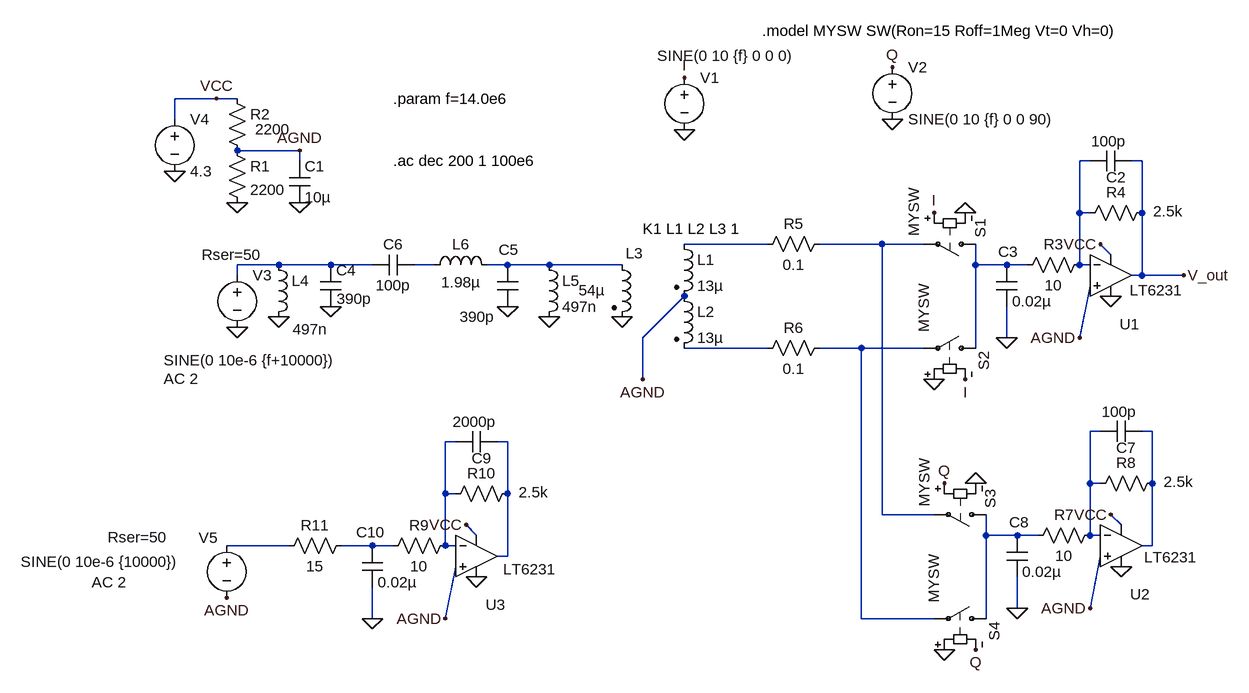
[diagram p0: schematic AC_SDR_IQ.asc]
AC_SDR_IQ.asc, the LTspice schematic file:
Version 4
SHEET 1 880 920
WIRE -1072 -192 -1136 -192
WIRE -1040 -192 -1072 -192
WIRE -1136 -160 -1136 -192
WIRE -944 -112 -1040 -112
WIRE -944 -96 -944 -112
WIRE 272 -96 256 -96
WIRE 352 -96 336 -96
WIRE 256 -16 256 -96
WIRE 272 -16 256 -16
WIRE 352 -16 352 -96
WIRE -224 32 -352 32
WIRE -48 32 -144 32
WIRE 16 32 -48 32
WIRE 304 48 288 32
WIRE -976 64 -1040 64
WIRE -896 64 -976 64
WIRE -832 64 -896 64
WIRE -736 64 -768 64
WIRE -624 64 -656 64
WIRE -560 64 -624 64
WIRE -448 64 -560 64
WIRE 96 64 96 32
WIRE 144 64 96 64
WIRE 176 64 144 64
WIRE 256 64 256 -16
WIRE 272 64 256 64
WIRE -1040 80 -1040 64
WIRE 352 80 352 -16
WIRE 352 80 336 80
WIRE 416 80 352 80
WIRE -416 176 -352 112
WIRE 144 176 144 128
WIRE 256 176 272 96
WIRE -224 192 -352 192
WIRE -80 192 -144 192
WIRE 16 192 -80 192
WIRE 96 192 96 64
WIRE -416 240 -416 176
WIRE 288 320 272 320
WIRE 368 320 352 320
WIRE -704 336 -720 336
WIRE -624 336 -640 336
WIRE 272 400 272 320
WIRE 288 400 272 400
WIRE 368 400 368 320
WIRE -720 416 -720 336
WIRE -704 416 -720 416
WIRE -624 416 -624 336
WIRE -48 448 -48 32
WIRE 32 448 -48 448
WIRE 320 464 304 448
WIRE -672 480 -688 464
WIRE 112 480 112 448
WIRE 160 480 112 480
WIRE 192 480 160 480
WIRE 272 480 272 400
WIRE 288 480 272 480
WIRE -960 496 -1056 496
WIRE -832 496 -880 496
WIRE -800 496 -832 496
WIRE -720 496 -720 416
WIRE -704 496 -720 496
WIRE 368 496 368 400
WIRE 368 496 352 496
WIRE -624 512 -624 416
WIRE -624 512 -640 512
WIRE 160 592 160 544
WIRE 272 592 288 512
WIRE -832 608 -832 560
WIRE -720 608 -704 528
WIRE -80 608 -80 192
WIRE 32 608 -80 608
WIRE 112 608 112 480
FLAG -1040 160 0
FLAG -448 144 0
FLAG -1136 -80 0
FLAG -1040 -32 0
FLAG -944 -32 0
FLAG -352 -144 0
FLAG 80 -16 0
FLAG 32 240 0
FLAG -32 -160 0
FLAG -944 -112 AGND
FLAG -416 240 AGND
FLAG 256 176 AGND
FLAG -352 -224 I
FLAG 32 -16 I
FLAG -32 -240 Q
FLAG -1072 -192 VCC
FLAG 288 32 VCC
FLAG 304 112 0
FLAG 80 240 I
FLAG 144 176 0
FLAG 416 80 V_out
FLAG -976 144 0
FLAG -896 128 0
FLAG -624 128 0
FLAG 96 400 0
FLAG 48 656 0
FLAG 272 592 AGND
FLAG 48 400 Q
FLAG 304 448 VCC
FLAG 320 528 0
FLAG 96 656 Q
FLAG 160 592 0
FLAG -720 608 AGND
FLAG -688 464 VCC
FLAG -672 544 0
FLAG -832 608 0
FLAG -1056 576 AGND
FLAG -560 144 0
SYMBOL Opamps\\LT6231 304 80 R0
WINDOW 0 14 75 Left 2
WINDOW 3 29 23 Left 2
SYMATTR InstName U1
SYMBOL sw 112 32 R90
WINDOW 0 -39 9 Left 2
WINDOW 3 -86 111 Left 2
SYMATTR InstName S1
SYMATTR Value MYSW
SYMBOL sw 112 192 M270
WINDOW 0 -34 3 Left 2
SYMATTR InstName S2
SYMATTR Value MYSW
SYMBOL voltage -352 -240 R0
WINDOW 123 0 0 Left 0
WINDOW 39 0 0 Left 0
WINDOW 3 -42 -18 Left 2
SYMATTR Value SINE(0 10 {f} 0 0 0)
SYMATTR InstName V1
SYMBOL voltage -32 -256 R0
WINDOW 123 0 0 Left 0
WINDOW 39 0 0 Left 0
SYMATTR InstName V2
SYMATTR Value SINE(0 10 {f} 0 0 90)
SYMBOL voltage -1040 64 R0
WINDOW 123 -113 175 Left 2
WINDOW 39 -55 -16 Left 2
WINDOW 3 -113 147 Left 2
SYMATTR Value2 AC 2
SYMATTR SpiceLine Rser=50
SYMATTR Value SINE(0 10e-6 {f+10000})
SYMATTR InstName V3
SYMBOL ind2 -368 16 R0
SYMATTR InstName L1
SYMATTR Value 13µ
SYMATTR Type ind
SYMBOL ind2 -368 96 R0
SYMATTR InstName L2
SYMATTR Value 13µ
SYMATTR Type ind
SYMBOL ind2 -464 48 R0
WINDOW 0 22 -2 Left 2
WINDOW 3 -51 55 Left 2
SYMATTR InstName L3
SYMATTR Value 54µ
SYMATTR Type ind
SYMBOL res -1056 -128 R0
SYMATTR InstName R1
SYMATTR Value 2200
SYMBOL res -1056 -208 R0
WINDOW 3 44 63 Left 2
SYMATTR Value 2200
SYMATTR InstName R2
SYMBOL cap -960 -96 R0
SYMATTR InstName C1
SYMATTR Value 10µ
SYMBOL voltage -1136 -176 R0
WINDOW 123 0 0 Left 0
WINDOW 39 0 0 Left 0
SYMATTR InstName V4
SYMATTR Value 4.3
SYMBOL res 272 48 R90
WINDOW 0 0 56 VBottom 2
WINDOW 3 32 56 VTop 2
SYMATTR InstName R3
SYMATTR Value 10
SYMBOL res 368 -32 R90
WINDOW 0 0 56 VBottom 2
WINDOW 3 -2 -24 VTop 2
SYMATTR InstName R4
SYMATTR Value 2.5k
SYMBOL cap 336 -112 R90
WINDOW 0 57 24 VBottom 2
WINDOW 3 -30 35 VTop 2
SYMATTR InstName C2
SYMATTR Value 100p
SYMBOL cap 128 64 R0
WINDOW 0 3 -20 Left 2
SYMATTR InstName C3
SYMATTR Value 0.02µ
SYMBOL cap -912 64 R0
WINDOW 3 25 52 Left 2
SYMATTR Value 390p
SYMATTR InstName C4
SYMBOL cap -640 64 R0
WINDOW 0 2 -23 Left 2
WINDOW 3 -58 80 Left 2
SYMATTR InstName C5
SYMATTR Value 390p
SYMBOL cap -768 48 R90
WINDOW 0 0 32 VBottom 2
WINDOW 3 32 32 VTop 2
SYMATTR InstName C6
SYMATTR Value 100p
SYMBOL ind -992 48 R0
WINDOW 3 37 115 Left 2
SYMATTR Value 497n
SYMATTR InstName L4
SYMBOL ind -576 48 R0
SYMATTR InstName L5
SYMATTR Value 497n
SYMBOL ind -752 80 R270
WINDOW 0 32 56 VTop 2
WINDOW 3 5 56 VBottom 2
SYMATTR InstName L6
SYMATTR Value 1.98µ
SYMBOL Opamps\\LT6231 320 496 R0
WINDOW 0 14 75 Left 2
WINDOW 3 35 18 Left 2
SYMATTR InstName U2
SYMBOL sw 128 448 R90
WINDOW 0 -39 9 Left 2
WINDOW 3 -86 111 Left 2
SYMATTR InstName S3
SYMATTR Value MYSW
SYMBOL sw 128 608 M270
WINDOW 0 -34 3 Left 2
SYMATTR InstName S4
SYMATTR Value MYSW
SYMBOL res 288 464 R90
WINDOW 0 0 56 VBottom 2
WINDOW 3 32 56 VTop 2
SYMATTR InstName R7
SYMATTR Value 10
SYMBOL res 384 384 R90
WINDOW 0 0 56 VBottom 2
WINDOW 3 -2 -24 VTop 2
SYMATTR InstName R8
SYMATTR Value 2.5k
SYMBOL cap 352 304 R90
WINDOW 0 57 24 VBottom 2
WINDOW 3 -30 35 VTop 2
SYMATTR InstName C7
SYMATTR Value 100p
SYMBOL cap 144 480 R0
WINDOW 0 4 -20 Left 2
SYMATTR InstName C8
SYMATTR Value 0.02µ
SYMBOL res -128 16 R90
WINDOW 0 0 56 VBottom 2
WINDOW 3 32 56 VTop 2
SYMATTR InstName R5
SYMATTR Value 0.1
SYMBOL res -128 176 R90
WINDOW 0 0 56 VBottom 2
WINDOW 3 32 56 VTop 2
SYMATTR InstName R6
SYMATTR Value 0.1
SYMBOL Opamps\\LT6231 -672 512 R0
WINDOW 0 14 75 Left 2
WINDOW 3 41 20 Left 2
SYMATTR InstName U3
SYMBOL res -704 480 R90
WINDOW 0 0 56 VBottom 2
WINDOW 3 32 56 VTop 2
SYMATTR InstName R9
SYMATTR Value 10
SYMBOL res -608 400 R90
WINDOW 0 0 56 VBottom 2
WINDOW 3 -2 -24 VTop 2
SYMATTR InstName R10
SYMATTR Value 2.5k
SYMBOL cap -640 320 R90
WINDOW 0 57 24 VBottom 2
WINDOW 3 -30 35 VTop 2
SYMATTR InstName C9
SYMATTR Value 2000p
SYMBOL cap -848 496 R0
WINDOW 0 -9 -21 Left 2
SYMATTR InstName C10
SYMATTR Value 0.02µ
SYMBOL res -864 480 R90
WINDOW 0 0 56 VBottom 2
WINDOW 3 32 56 VTop 2
SYMATTR InstName R11
SYMATTR Value 15
SYMBOL voltage -1056 480 R0
WINDOW 123 -208 72 Left 2
WINDOW 39 -183 3 Left 2
WINDOW 3 -317 41 Left 2
WINDOW 0 -43 4 Left 2
SYMATTR Value2 AC 2
SYMATTR SpiceLine Rser=50
SYMATTR Value SINE(0 10e-6 {10000})
SYMATTR InstName V5
TEXT -232 -296 Left 2 !.model MYSW SW(Ron=15 Roff=1Meg Vt=0 Vh=0)
TEXT -416 8 Left 2 !K1 L1 L2 L3 1
TEXT -800 -192 Left 2 !.param f=14.0e6
TEXT -800 -96 Left 2 !.ac dec 200 1 100e6

The netlist it stands for:
* AC_SDR_IQ.asc
XU1 AGND N001 V_out VCC 0 LT6231  ; pins In+ In- OUT V+ V-
S1 N007 N003 I 0 MYSW
S2 N007 N009 0 I MYSW
V1 I 0 SINE(0 10 {f} 0 0 0)
V2 Q 0 SINE(0 10 {f} 0 0 90)
V3 N004 0 SINE(0 10e-6 {f+10000}) AC 2 Rser=50
L1 N002 AGND 13µ
L2 AGND N008 13µ
L3 N006 0 54µ
R1 AGND 0 2200
R2 VCC AGND 2200
C1 AGND 0 10µ
V4 VCC 0 4.3
R3 N001 N007 10
R4 V_out N001 2.5k
C2 V_out N001 100p
C3 N007 0 0.02µ
C4 N004 0 390p
C5 N006 0 390p
C6 N005 N004 100p
L4 N004 0 497n
L5 N006 0 497n
L6 N005 N006 1.98µ
XU2 AGND N010 N011 VCC 0 LT6231  ; pins In+ In- OUT V+ V-
S3 N014 N003 Q 0 MYSW
S4 N014 N009 0 Q MYSW
R7 N010 N014 10
R8 N011 N010 2.5k
C7 N011 N010 100p
C8 N014 0 0.02µ
R5 N003 N002 0.1
R6 N009 N008 0.1
XU3 AGND N012 N013 VCC 0 LT6231  ; pins In+ In- OUT V+ V-
R9 N012 N016 10
R10 N013 N012 2.5k
C9 N013 N012 2000p
C10 N016 0 0.02µ
R11 N016 N015 15
V5 N015 AGND SINE(0 10e-6 {10000}) AC 2 Rser=50
.model MYSW SW(Ron=15 Roff=1Meg Vt=0 Vh=0)
K1 L1 L2 L3 1
.param f=14.0e6
.ac dec 200 1 100e6
.lib LTC2.lib
.backanno
.end